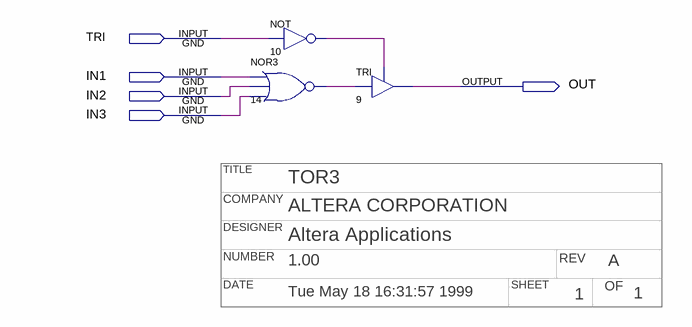
[diagram p0: schematic sheet]
// Quartus schematic tor3.bdf as structural Verilog: 3 symbols, 5 pins
// Title block: TITLE: TOR3; COMPANY: ALTERA CORPORATION; DESIGNER: Altera Applications; NUMBER: 1.00; REV: A; DATE: Tue May 18 16:31:57 1999; SHEET: 1; OF: 1
module tor3 (
  input  TRI,
  input  IN1,
  input  IN2,
  input  IN3,
  output OUT
);

  wire n10_out, n14_out;

  not u_10 (n10_out, TRI);
  nor u_14 (n14_out, IN1, IN2, IN3);
  TRI u_9 (.IN(n14_out), .OE(n10_out), .OUT(OUT));
endmodule
